# EAGLE schematic Mozard Nano (EAGLE 9.0.1)
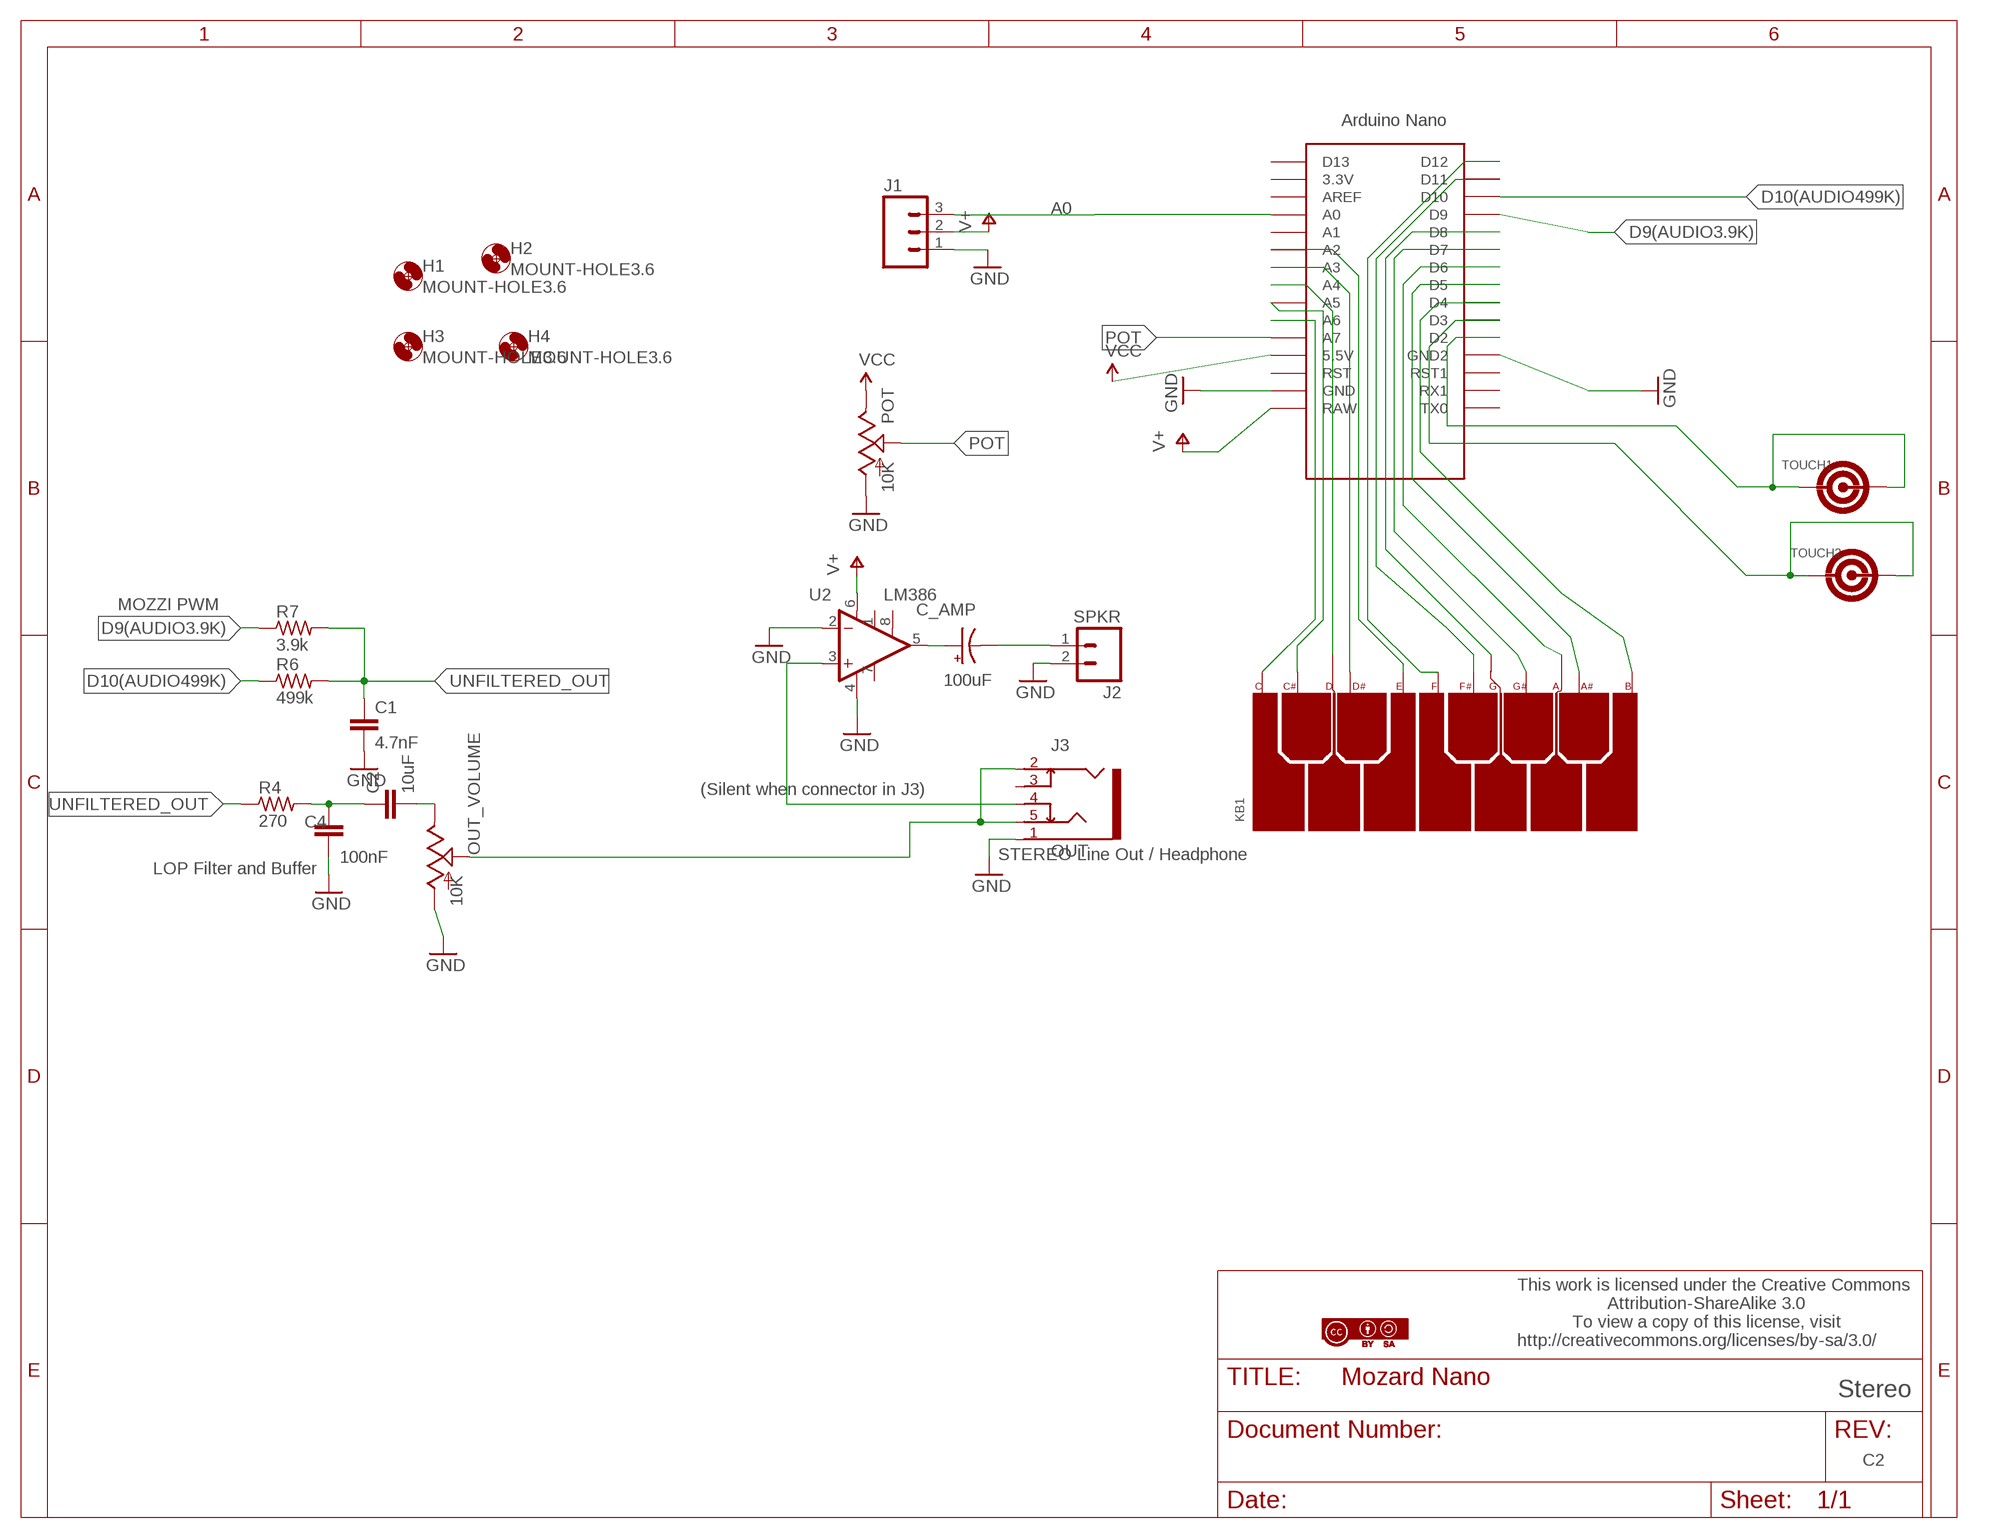
[diagram p0: schematic, sheet 1]

## Parts
C1  4.7nF  0.1UF-50V-20%(PTH)KIT-EZ  [CAP-PTH-SMALL-KIT]
C2  10uF  0.1UF-50V-20%(PTH)KIT-EZ  [CAP-PTH-SMALL-KIT]
C4  100nF  0.1UF-50V-20%(PTH)KIT-EZ  [CAP-PTH-SMALL-KIT]
C_AMP  100uF  CPOL-RADIAL-10UF-25V  [CPOL-RADIAL-10UF-25V]
H1  MOUNT-HOLE3.6  [3,6]
H2  MOUNT-HOLE3.6  [3,6]
H3  MOUNT-HOLE3.6  [3,6]
H4  MOUNT-HOLE3.6  [3,6]
J1  M03SCREW  [SCREWTERMINAL-3.5MM-3]
J2  SPKR  M023.5MM  [SCREWTERMINAL-3.5MM-2]
J3  OUT  STEREO-AUDIO-3.5MM-SWITCHED  [STEREO-AUDIO-3.5MM-SWITCHED]
KB1  PCB-KEYBOARD4  [PCB-KEYBOARD4]
OUT_VOLUME  10K  POTALPS-KIT  [ALPS_POT_KIT]
POT  10K  POTALPS-KIT  [ALPS_POT_KIT]
R4  270  R-US_0204/5  [0204/5]
R6  499k  R-US_0204/5  [0204/5]
R7  3.9k  R-US_0204/5  [0204/5]
TOUCH1  PCB-TOUCHPAD2  [PCB-TOUCHPAD2]
TOUCH2  PCB-TOUCHPAD2  [PCB-TOUCHPAD2]
U2  LM386  [DIP08]
U$1  NANO  [NANO]
U$2  CC-BY-SA-LOGO2  [CC-BY-SA-LOGO2]

## Nets
A0: J1.3 U$1.A0
D2(C): KB1.D# U$1.A3
D9(AUDIO3.9K): R7.1 U$1.D9
D10(AUDIO499K): R6.1 U$1.D10
GND: C1.2 C4.2 J1.1 J2.2 J3.1 OUT_VOLUME.P$3(A) POT.P$3(A) U2.2(-IN) U2.4(V-) U$1.GND U$1.GND1(GND2)
N$1: C_AMP.- J2.1
N$2: KB1.E U$1.A2
N$3: KB1.C U$1.A6
N$4: C2.1 C4.1 R4.2
N$5: C2.2 OUT_VOLUME.P$1(E)
N$6: J3.4 U2.3(+IN)
N$7: C_AMP.+ U2.5(OUT)
N$8: J3.2 J3.5 OUT_VOLUME.P$2(S)
N$9: KB1.C# U$1.A5
N$10: KB1.D U$1.A4
N$11: KB1.F U$1.D12
N$12: KB1.F# U$1.D11
N$13: KB1.G U$1.D8
N$14: KB1.G# U$1.D7
N$15: KB1.A U$1.D6
N$16: KB1.A# U$1.D5
N$17: KB1.B U$1.D4
POT: POT.P$2(S) U$1.A7
TOUCH_A: TOUCH1.1 TOUCH1.2 U$1.D2
TOUCH_B: TOUCH2.1 TOUCH2.2 U$1.D3
UNFILTERED_OUT: C1.1 R4.1 R6.2 R7.2
V+: J1.2 U2.6(V+) U$1.RAW
VCC: POT.P$1(E) U$1.5V(5.5V)
Unconnected: J3.3 U2.1(GAIN) U2.7(BP) U2.8(GAIN) U$1.3.3V U$1.A1 U$1.AREF U$1.D13 U$1.RST U$1.RST1 U$1.RX1 U$1.TX0

## Notes on the sheet
- MOZZI PWM
- (Silent when connector in J3)
- STEREO Line Out / Headphone
- LOP Filter and Buffer
- This work is licensed under the Creative Commons
                    Attribution-ShareAlike 3.0
             To view a copy of this license, visit
  http://creativecommons.org/licenses/by-sa/3.0/
- Stereo
- C2

## Library data of the parts
C1 C2 C4 = SparkFun-Capacitors:0.1UF-50V-20%(PTH): CAP-08370; PROD_ID: CAP-08370
C_AMP = Mitch-parts:CPOL-RADIAL-10UF-25V: Electrolytic Polarized
H1-H4 = holes:MOUNT-HOLE: MOUNTING HOLE with drill center marker
J1 = SparkFun-Connectors:M03: Header 3 Standard 3-pin 0.1" header. Use with straight break away headers (SKU : PRT-00116), right angle break away headers (PRT-00553), swiss pins (PRT-00743), machine pins (PRT-00117), and female headers (PRT-00115). Molex polarized connector foot print use with SKU : PRT-08232 with associated crimp pins and housings.; PROD_ID: CONN-08288
J2 = SparkFun-Connectors:M02: Standard 2-pin 0.1" header. Use with - straight break away headers ( PRT-00116) - right angle break away headers (PRT-00553) - swiss pins (PRT-00743) - machine pins (PRT-00117) - female headers (PRT-00115) Molex polarized connector foot print use with: PRT-08233 with associated crimp pins and housings. 2.54_SCREWTERM for use with PRT-10571. 3.5mm Screw Terminal footprints for PRT-08084 5mm Screw Terminal footprints for use with PRT-08432; PROD_ID: CONN-08399
J3 = Mitch-parts:STEREO-AUDIO-3.5MM-SWITCHED: 3.5mm mono audio jack, with switch Kycon STX-3120-5B-284C (284C is blue) Mouser part #: 806-STX-31205B284C (blue) 1 - ground 2 - tip 3 - tip switch 4 - ring switch 5 - ring
KB1 = Mitch-parts:PCB-KEYBOARD4: 1-octave PCB touch keyboard (without top C)
OUT_VOLUME POT = SparkFun-Electromechanical:POT; PROD_ID: RES-09177
R4 R6 R7 = adafruit:R-US_: RESISTOR, American symbol
TOUCH1 TOUCH2 = TOF:PCB-TOUCHPAD2: PCB resistive Touch-pad for touch-switch
U2 = Mitch-parts:LM386: low voltage audio power amplifier
U$1 = Arduino-clone:NANO: Arduino Nano
U$2 = Mitch-parts:CC-BY-SA-LOGO2: CC BY-SA logo